# EAGLE schematic train gate (EAGLE 6.5.0)
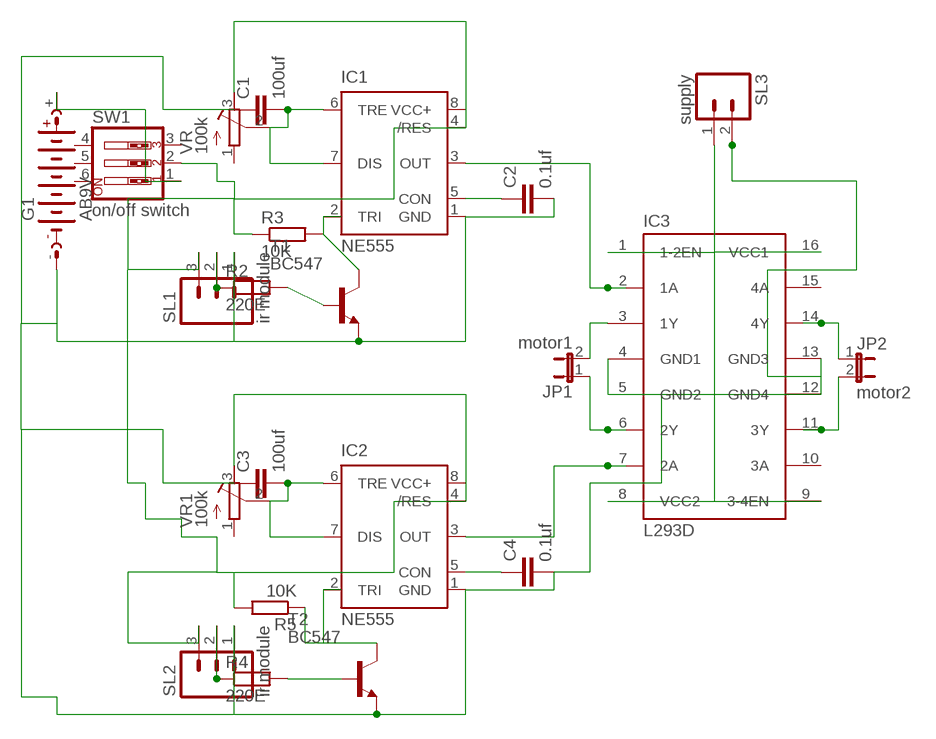
[diagram p0: schematic, sheet 1]

## Parts
C1  100uf  C5/7.2  [C5B7.2]
C2  0.1uf  C2,5-3  [C2.5-3]
C3  100uf  C5/7.2  [C5B7.2]
C4  0.1uf  C2,5-3  [C2.5-3]
G1  AB9V  [AB9V]
IC1  NE555  [DIL-08]
IC2  NE555  [DIL-08]
IC3  L293D  [DIL16]
JP1  motor1  JP1E  [JP1]
JP2  motor2  JP1E  [JP1]
R2  220E  R-EU_0204/7  [0204/7]
R3  10K  R-EU_0204/7  [0204/7]
R4  220E  R-EU_0204/7  [0204/7]
R5  10K  R-EU_0204/7  [0204/7]
SL1  ir module  M03  [03P]
SL2  ir module  M03  [03P]
SL3  supply  M02  [02P]
SW1  on/off switch  SW_DIP-3  [EDG-03]
T1  BC547  [TO92]
T2  BC547  [TO92]
VR  100k  R-TRIMM64P  [RTRIM64P]
VR1  100k  R-TRIMM64P  [RTRIM64P]

## Nets
N$1: C1.2 IC1.6(TRE) IC1.7(DIS) VR.2(S)
N$2: C3.2 IC2.6(TRE) IC2.7(DIS) VR1.2(S)
N$3: R2.1 SL1.2
N$4: R4.1 SL2.2
N$5: C2.1 IC1.5(CON)
N$7: R4.2 T2.2(B)
N$8: G1.+ SW1.1
N$9: IC1.2(TRI) R3.2 T1.3(C)
N$10: C4.1 IC2.5(CON)
N$11: IC2.2(TRI) R5.1 T2.3(C)
N$12: C1.1 C2.2 C3.1 C4.2 G1.- IC1.1(GND) IC2.1(GND) IC3.4(GND1) IC3.5(GND2) IC3.12(GND4) IC3.13(GND3) SL1.1 SL2.1 SL3.2 T1.1(E) T2.1(E)
N$13: IC3.1(1-2EN) IC3.8(VCC2) IC3.9(3-4EN) IC3.16(VCC1) SL3.1
N$14: IC1.4(/RES) IC1.8(VCC+) IC2.4(/RES) IC2.8(VCC+) R3.1 R5.2 SL1.3 SL2.3 SW1.2 VR1.3(A) VR.3(A)
N$16: R2.2 T1.2(B)
N$17: IC3.3(1Y) JP1.2
N$18: IC3.6(2Y) JP1.1
N$19: IC3.14(4Y) JP2.1
N$20: IC3.11(3Y) JP2.2
N$21: IC1.3(OUT) IC3.2(1A)
N$22: IC2.3(OUT) IC3.7(2A)
Unconnected: IC3.10(3A) IC3.15(4A) SW1.3 SW1.4 SW1.5 SW1.6 VR1.1(E) VR.1(E)

## Library data of the parts
C1-C4 = capacitor-wima:C: CAPACITOR naming: grid - package width
G1 = battery:AB9V: 9-V BATTERY CLIP
IC1 IC2 = st-microelectronics:NE555: General purpose bipolar Timer; MF: Arrow Electronics; MPN: NE555N; OC_FARNELL: 1467742; OC_NEWARK: 89K1486
IC3 = st-microelectronics:L293D: PUSH-PULL 4 CHANNEL DRIVER; MPN: L293D; OC_FARNELL: 9589619; OC_NEWARK: 56P8249
JP1 JP2 = jumper:JP1E: JUMPER
R2-R5 = rcl:R-EU_: RESISTOR, European symbol
SL1 SL2 = con-amp-quick:M03: AMP QUICK CONNECTOR; OC_FARNELL: unknown; OC_NEWARK: unknown
SL3 = con-amp-quick:M02: AMP QUICK CONNECTOR; OC_FARNELL: unknown; OC_NEWARK: unknown
SW1 = special:SW_DIP-3: DIP SWITCH
T1 T2 = transistor:BC547: NPN TRANSISTOR
VR VR1 = resistor:R-TRIMM: Trimm resistor